# EAGLE schematic boardBase (EAGLE 8.4.0)
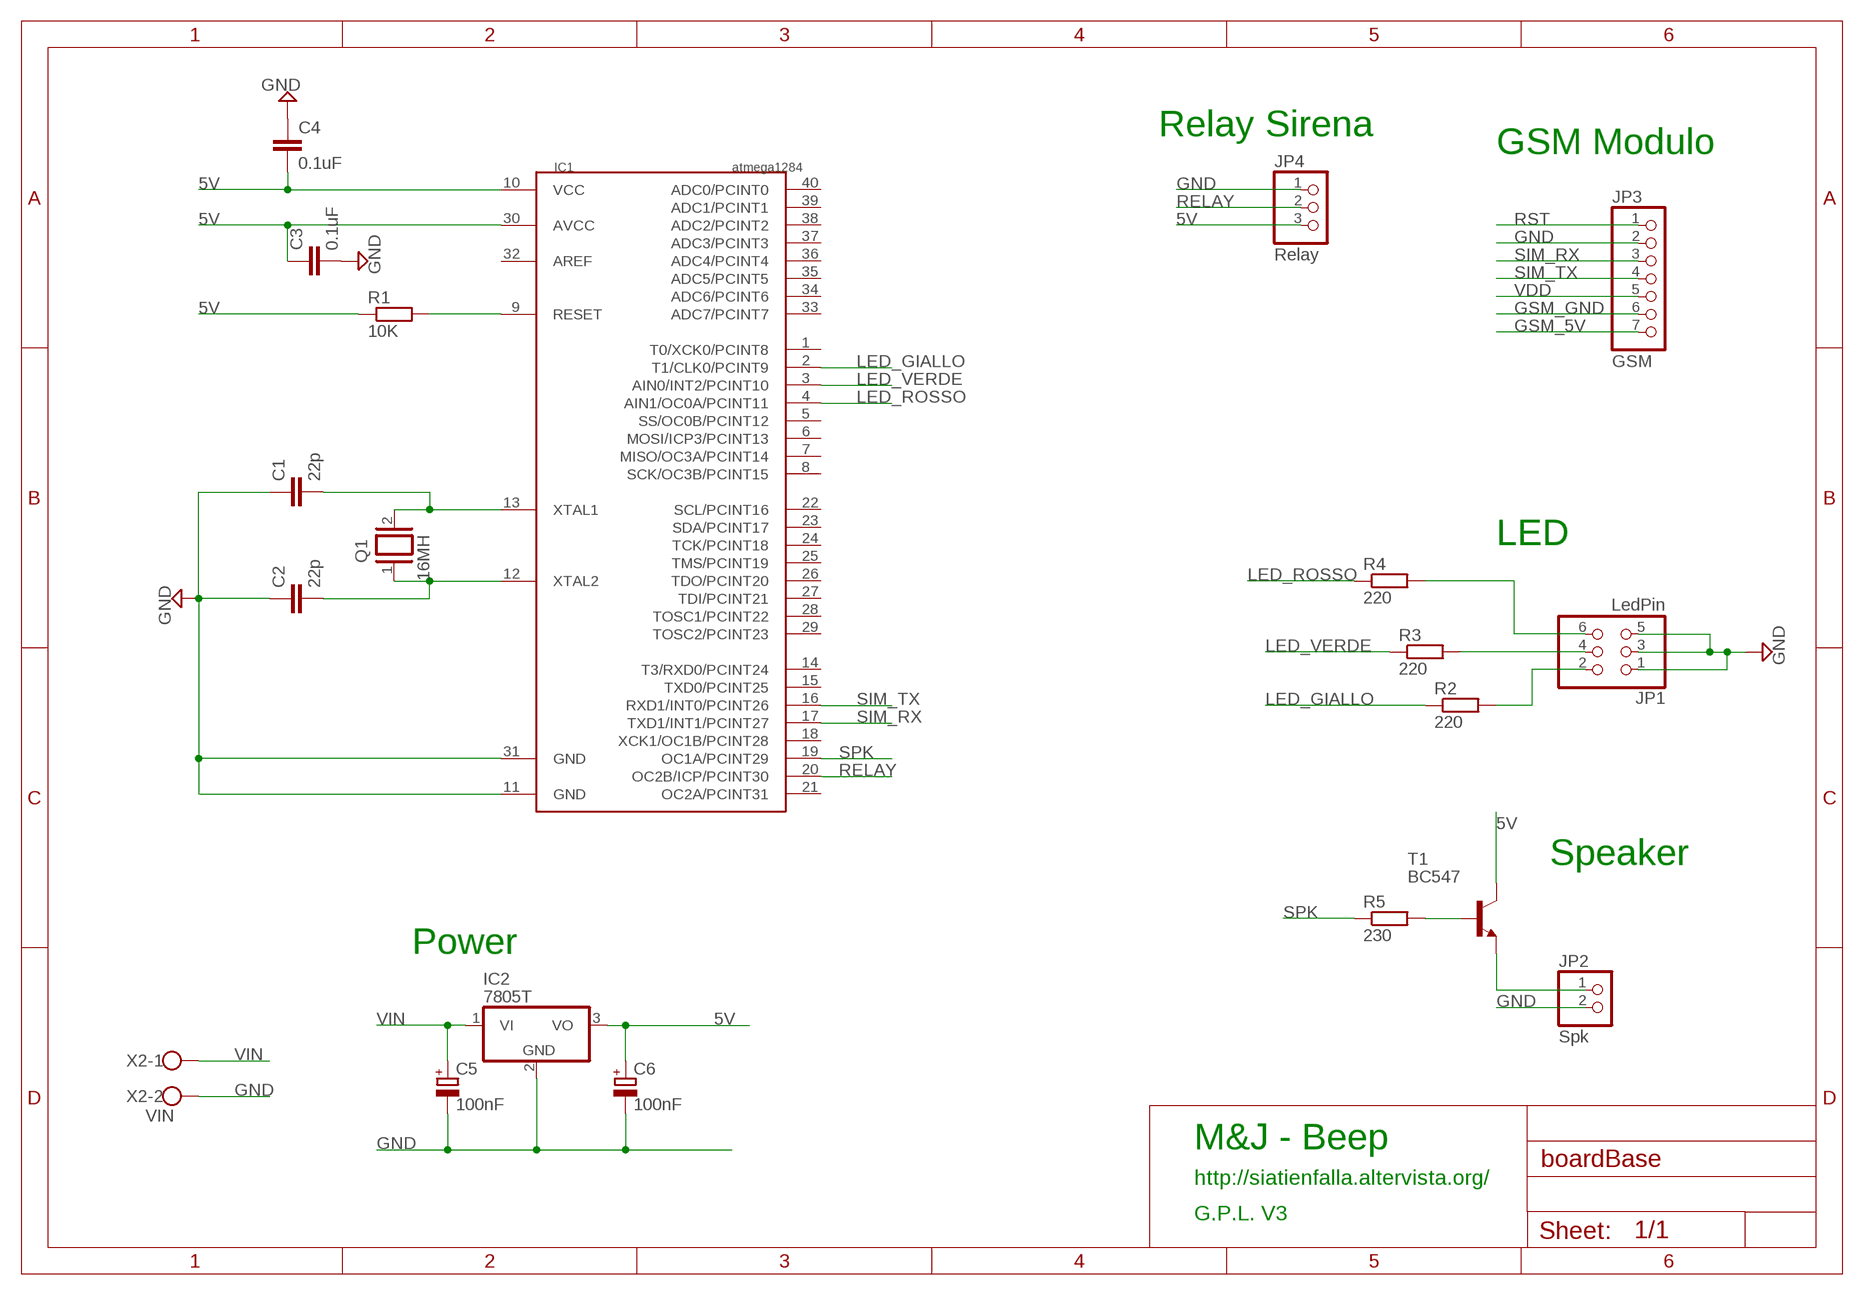
[diagram p0: schematic, sheet 1]

## Parts
C1  22p  C-EU025-024X044  [C025-024X044]
C2  22p  C-EU025-024X044  [C025-024X044]
C3  0.1uF  C-EU025-025X050  [C025-025X050]
C4  0.1uF  C-EU025-025X050  [C025-025X050]
C5  100nF  CPOL-EUE3.5-10  [E3,5-10]
C6  100nF  CPOL-EUE3.5-10  [E3,5-10]
IC1  atmega1284  MEGA1284P  [DIL40]
IC2  7805T  [TO220H]
JP1  LedPin  PINHD-2X3  [2X03]
JP2  Spk  PINHD-1X2  [1X02]
JP3  GSM  PINHD-1X7  [1X07]
JP4  Relay  PINHD-1X3  [1X03]
Q1  16MH  XTAL/S  [QS]
R1  10K  R-EU_0207/10  [0207/10]
R2  220  R-EU_0207/10  [0207/10]
R3  220  R-EU_0207/10  [0207/10]
R4  220  R-EU_0207/10  [0207/10]
R5  230  R-EU_0207/10  [0207/10]
T1  BC547  [TO92]
X2  VIN  W237-102  [W237-102]

## Nets
5V: C3.1 C4.2 C6.+ IC1.10(VCC) IC1.30(AVCC) IC2.3(VO) JP4.3 R1.1 T1.3(C)
GND: C1.1 C2.1 C3.2 C4.1 C5.- C6.- IC1.11(GND) IC1.31(GND) IC2.2(GND) JP1.1 JP1.3 JP1.5 JP2.2 JP3.2 JP4.1 X2.2
GSM_5V: JP3.7
GSM_GND: JP3.6
LED_GIALLO: IC1.2(T1/CLK0/PCINT9) R2.1
LED_ROSSO: IC1.4(AIN1/OC0A/PCINT11) R4.1
LED_VERDE: IC1.3(AIN0/INT2/PCINT10) R3.1
N$1: C2.2 IC1.12(XTAL2) Q1.1
N$2: C1.2 IC1.13(XTAL1) Q1.2
N$3: IC1.9(RESET) R1.2
N$7: JP1.2 R2.2
N$8: JP1.4 R3.2
N$9: JP1.6 R4.2
N$11: R5.2 T1.2(B)
N$12: JP2.1 T1.1(E)
RELAY: IC1.20(OC2B/ICP/PCINT30) JP4.2
RST: JP3.1
SIM_RX: IC1.17(TXD1/INT1/PCINT27) JP3.3
SIM_TX: IC1.16(RXD1/INT0/PCINT26) JP3.4
SPK: IC1.19(OC1A/PCINT29) R5.1
VDD: JP3.5
VIN: C5.+ IC2.1(VI) X2.1
Unconnected: IC1.1(T0/XCK0/PCINT8) IC1.5(SS/OC0B/PCINT12) IC1.6(MOSI/ICP3/PCINT13) IC1.7(MISO/OC3A/PCINT14) IC1.8(SCK/OC3B/PCINT15) IC1.14(T3/RXD0/PCINT24) IC1.15(TXD0/PCINT25) IC1.18(XCK1/OC1B/PCINT28) IC1.21(OC2A/PCINT31) IC1.22(SCL/PCINT16) IC1.23(SDA/PCINT17) IC1.24(TCK/PCINT18) IC1.25(TMS/PCINT19) IC1.26(TDO/PCINT20) IC1.27(TDI/PCINT21) IC1.28(TOSC1/PCINT22) IC1.29(TOSC2/PCINT23) IC1.32(AREF) IC1.33(ADC7/PCINT7) IC1.34(ADC6/PCINT6) IC1.35(ADC5/PCINT5) IC1.36(ADC4/PCINT4) IC1.37(ADC3/PCINT3) IC1.38(ADC2/PCINT2) IC1.39(ADC1/PCINT1) IC1.40(ADC0/PCINT0)

## Notes on the sheet
- Relay Sirena
- GSM Modulo
- LED
- Speaker
- Power
- M&J - Beep
- http://siatienfalla.altervista.org/
- G.P.L. V3

## Library data of the parts
C1-C4 = rcl:C-EU: CAPACITOR, European symbol
C5 C6 = rcl:CPOL-EU: POLARIZED CAPACITOR, European symbol
IC1 = 1284p:MEGA1284P: Atmel ATmega1284P 8-bit AVR Microcontroller
IC2 = linear:78*: Positive VOLTAGE REGULATOR Source: http://cache.national.com/ds/LM/LM78L05.pdf http://www.fairchildsemi.com/ds/LM/LM7805.pdf
JP1 = pinhead:PINHD-2X3: PIN HEADER
JP2 = pinhead:PINHD-1X2: PIN HEADER
JP3 = pinhead:PINHD-1X7: PIN HEADER
JP4 = pinhead:PINHD-1X3: PIN HEADER
Q1 = special:XTAL/S: CRYSTAL
R1-R5 = rcl:R-EU_: RESISTOR, European symbol
T1 = transistor:BC547: NPN TRANSISTOR
X2 = con-wago-500:W237-102: WAGO SCREW CLAMP; MPN: 237-102; OC_FARNELL: unknown; OC_NEWARK: 70K9898